# Altium schematic sheet obc-v2_POWER.SchDoc
size 420 x 297 mm; SheetNumber: 3; SheetTotal: 21
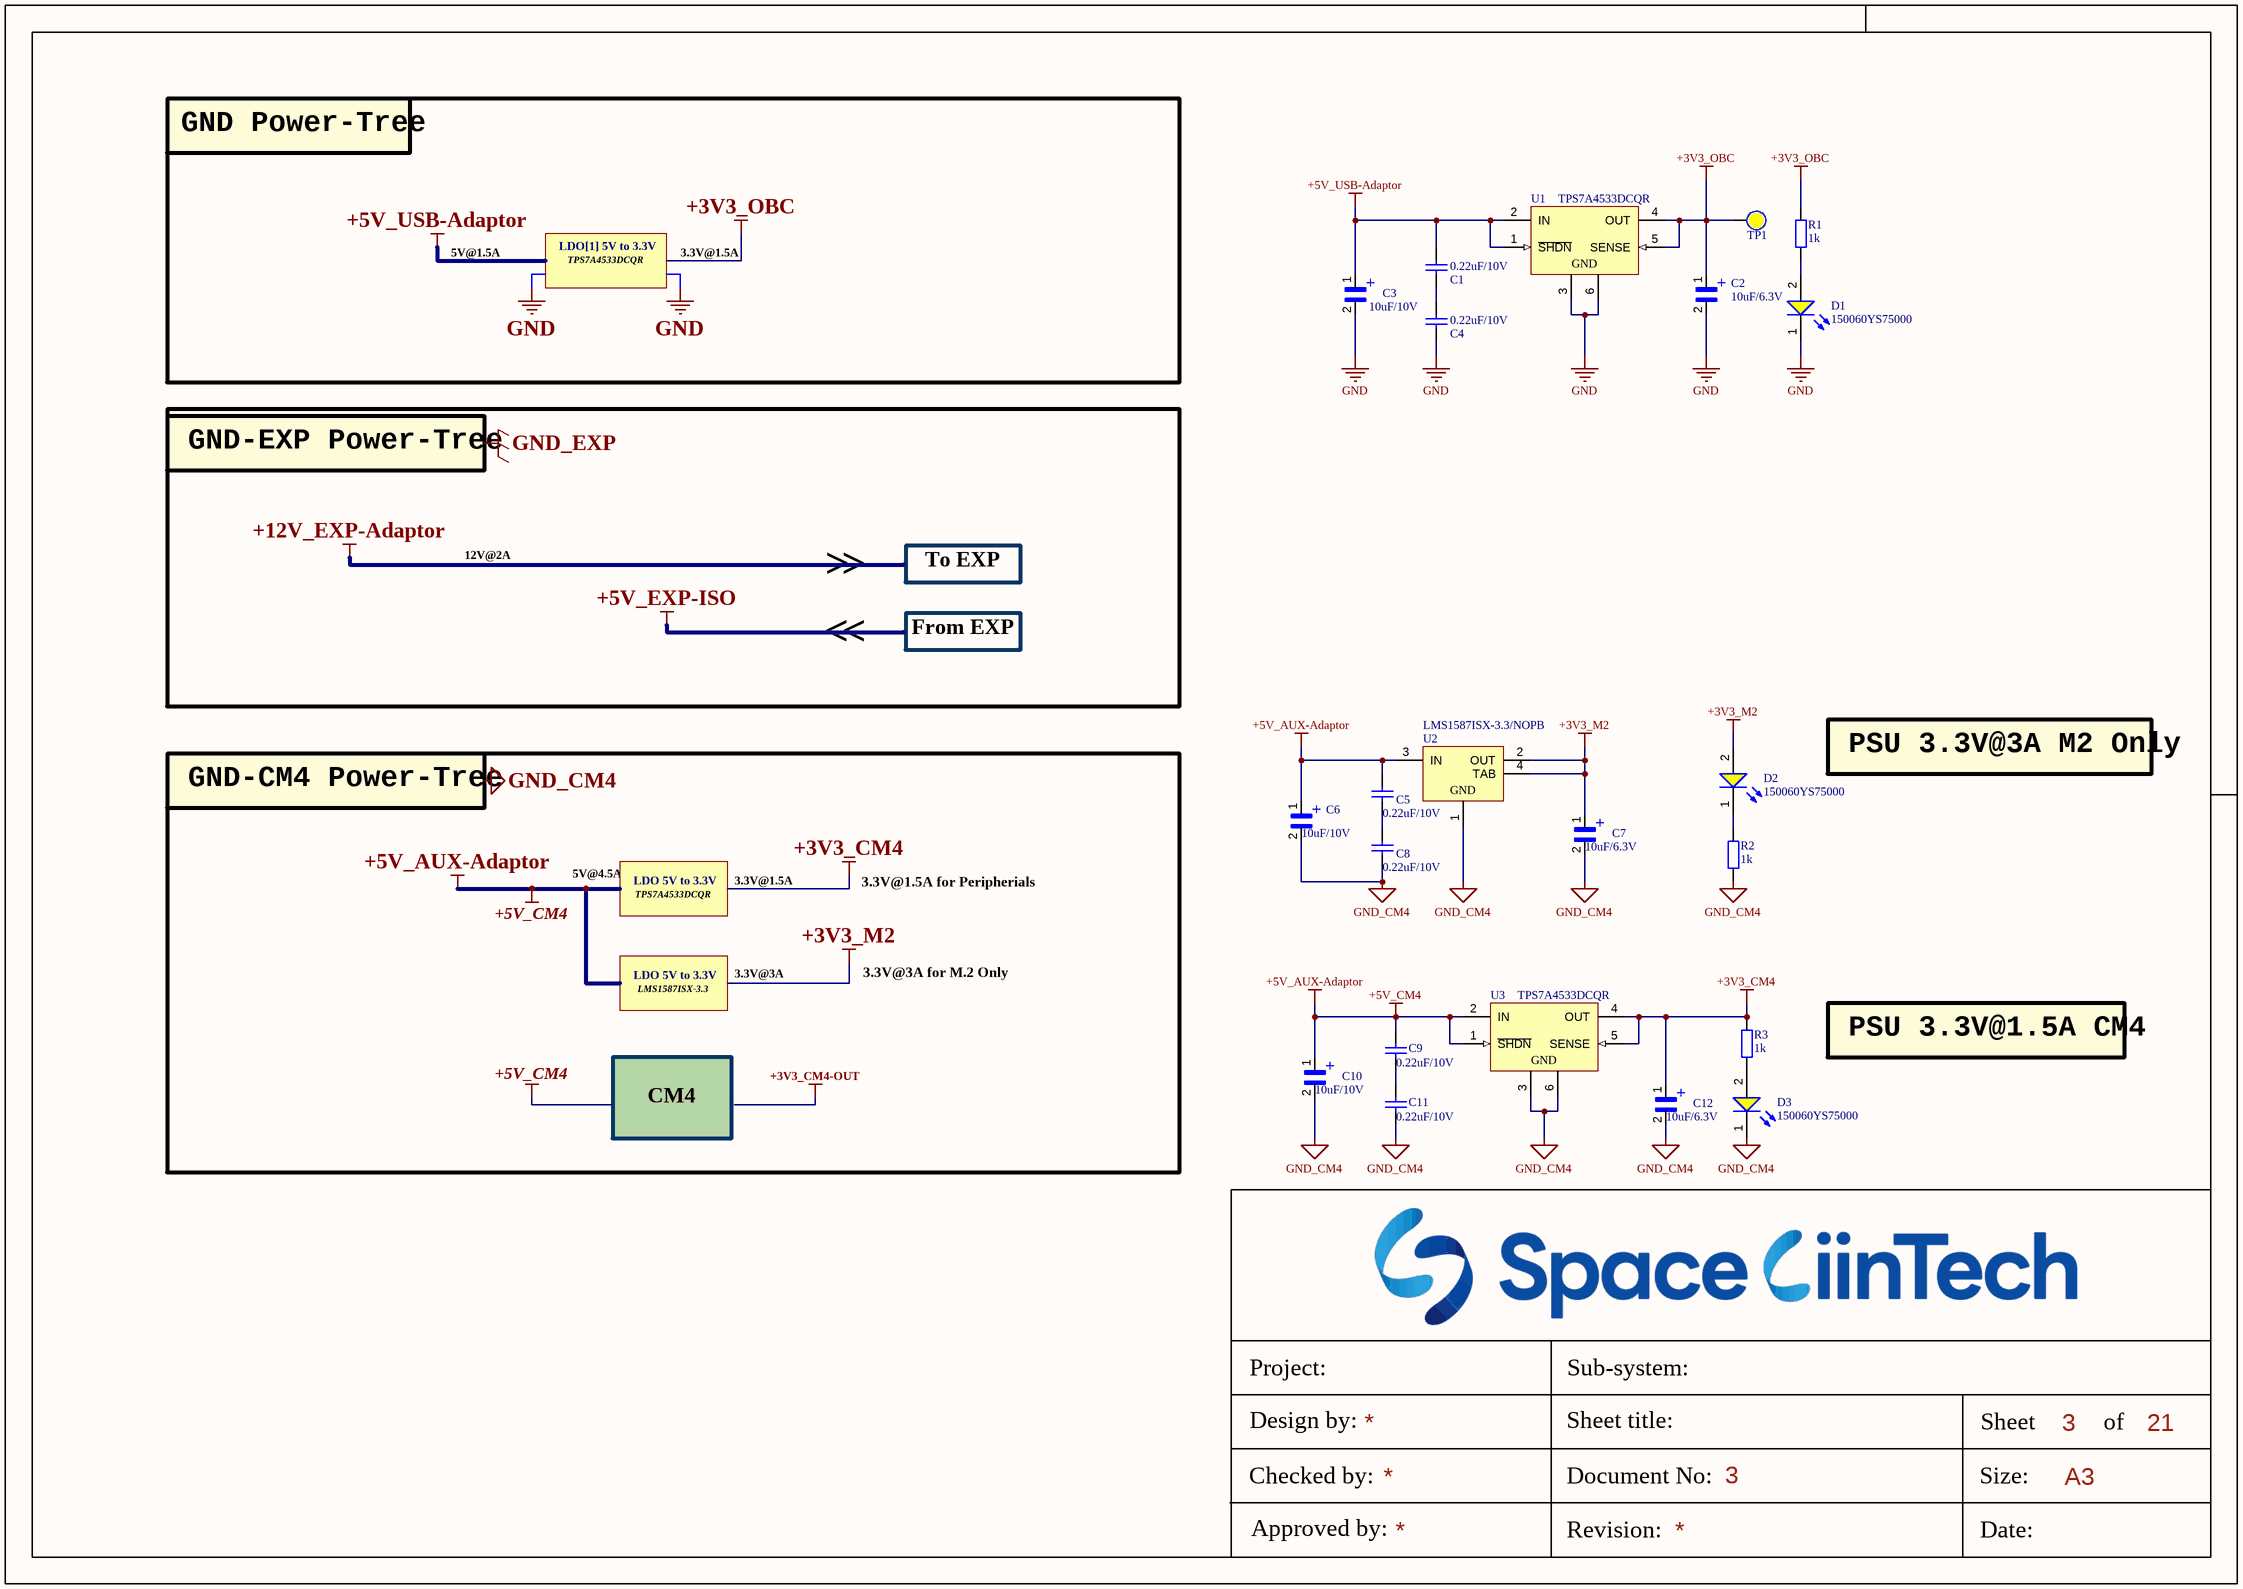
[diagram p0: obc-v2_POWER.SchDoc]

## Parts
C1  0.22uF/10V  [CAP_C_1005X60]
C2  10uF/6.3V  [CAP_MP_2012X170]
C3  10uF/10V  [CAP_MP_2012X170]
C4  0.22uF/10V  [CAP_C_1005X60]
C5  0.22uF/10V  [CAP_C_1005X60]
C6  10uF/10V  [CAP_MP_2012X170]
C7  10uF/6.3V  [CAP_MP_2012X170]
C8  0.22uF/10V  [CAP_C_1005X60]
C9  0.22uF/10V  [CAP_C_1005X60]
C10  10uF/10V  [CAP_MP_2012X170]
C11  0.22uF/10V  [CAP_C_1005X60]
C12  10uF/6.3V  [CAP_MP_2012X170]
D1  150060YS75000  [WL-SMCW_0603_150060xx75000]
D2  150060YS75000  [WL-SMCW_0603_150060xx75000]
D3  150060YS75000  [WL-SMCW_0603_150060xx75000]
R1  1k  [RES_C_1608X60]
R2  1k  [RES_C_1608X60]
R3  1k  [RES_C_1608X60]
TP1  (no value)  [Test Point 1 Side]  (no BOM)
U1  TPS7A4533DCQR  [DCQ0006A_M]
U2  LMS1587ISX-3.3/NOPB  [TS3B_L]
U3  TPS7A4533DCQR  [DCQ0006A_M]

## Nets
+3V3_CM4: C12.1 R3.2 U3.4(OUT) U3.5(SENSE)
+3V3_M2: C7.1 D2.2(A) U2.2(OUT) U2.4(TAB)
+3V3_OBC: C2.1 R1.2 TP1.0 U1.4(OUT) U1.5(SENSE)
+5V_AUX-Adaptor: C5.1 C6.1 C9.1 C10.1 U2.3(IN) U3.1(~{SHDN}) U3.2(IN)  [also labelled +5V_CM4]
+5V_USB-Adaptor: C1.1 C3.1 U1.1(~{SHDN}) U1.2(IN)
GND: C2.2 C3.2 C4.2 D1.1(K) U1.3(GND) U1.6(GND)
GND_CM4: C6.2 C7.2 C8.2 C10.2 C11.2 C12.2 D3.1(K) R2.2 U2.1(GND) U3.3(GND) U3.6(GND)
NetC1_2: C1.2 C4.1
NetC5_2: C5.2 C8.1
NetC9_2: C9.2 C11.1
NetD1_2: D1.2(A) R1.1
NetD2_1: D2.1(K) R2.1
NetD3_2: D3.2(A) R3.1

## Notes on the sheet
- GND Power-Tree
- 5V@1.5A
- LDO[1] 5V to 3.3V
- TPS7A4533DCQR
- 3.3V@1.5A
- GND-EXP Power-Tree
- 12V@2A
- >
- To EXP
- <
- From EXP
- GND-CM4 Power-Tree
- PSU 3.3V@3A M2 Only
- 5V@4.5A
- LDO 5V to 3.3V
- 3.3V@1.5A for Peripherials
- LMS1587ISX-3.3
- 3.3V@3A
- 3.3V@3A for M.2 Only
- PSU 3.3V@1.5A CM4
- CM4
- Labels drawn without touching a wire or pin: GND, GND_CM4, GND_EXP
- Project:
- Sub-system:
- Design by:
- Sheet title:
- Sheet
- A3
- of
- Checked by:
- Approved by:
- Revision:
- Document No:
- Size:
- Date:
- (in symbol TACR686M003RTA) +

## Library data of the parts
C1 C4 C5 C8 C9 C11 = Tu 0402 33nF 10V: CAPC; Chung_Loai: Dán; Don_Vi: Con; So_Chan: 2; Ten_Linh_Kien: Tụ 0402 33nF X7R 10V GRM155R71A333KA01D; Ma_Hang: MH007853; Kieu_Chan: *
C2 C3 C6 C7 C10 C12 = TACR686M003RTA: CAPP; MF: AVX; Availability: Unavailable; SnapEDA_Link: https://www.snapeda.com/parts/TACR686M003RTA/AVX/view-part/1745975/?ref=snap; MP: TACR686M003RTA; Value: *; Price: None; Package: 0805 AVX
D1-D3 = CMP-1426-00005-2: LED YELLOW CLEAR 0603 SMD; NexarPartId: 29687085; Wavelength: 590nm; Luminous Intensity: 120mcd; Peak Wavelength: 595nm; Forward Current: 100mA; Power Dissipation: 72mW; Forward Voltage: 2V; Test Current: 20mA; Reverse Voltage: 5V; Lens Style: Clear, Rectangular; Max Junction Temperature (Tj): 95°C; Viewing Angle: 140°; Case Code (Imperial): 0603; Height: 700µm; REACH SVHC: Unknown; Dominant Wavelength: 590nm; Min Operating Temperature: -40°C; Color: Yellow; Width: 800µm; Mount: Surface Mount; Packaging: Tape and Reel; Max Operating Temperature: 85°C; RoHS: Compliant; Max Reverse Voltage (DC): 5V; Case Code (Metric): 1608; Length: 1.6mm; Case/Package: 0603
R1-R3 = Tro 0603 1% 10k: RES; Chung_Loai: Dán; Don_Vi: Con; So_Chan: 2; Ten_Linh_Kien: Trở 0603 1% 10k; Ma_Hang: MH006333; Kieu_Chan: *
TP1 = Test Point: Solder: NF
U1 U3 = CMP-0395-00360-2: Single Output Fast Transient Response LDO, 1.5 A, Fixed 3.3 V Output, 2.1 to 20 V Input, 6-pin SOT-223 (DCQ), -40 to 125 degC, Green (RoHS & no Sb/Br); Manufacturer: Texas Instruments; Vout Adj(Max)(V): 3.3; Vin(Max)(V): 20; Accuracy(%): 1; SubFamily: Single Channel LDO; Vin(Min)(V): 2.1; Iout(Max)(A): 1.5; Vdo(Typ)(mV): 300; Eco-Plan: Green (RoHS & no Sb/Br); Mounting Technology: Surface Mount; PackageDescription: 6-Pin Plastic Small Outline, Body 3.5 x 6.5 mm, Pitch 1.27 mm; ComponentLink2URL: http://www.ti.com/general/docs/lit/getliterature.tsp?genericPartNumber=TPS7A4533&fileType=pdf; PackageReference: DCQ0006A; ComponentLink3Description: Package Specification; ComponentLink2Description: Datasheet; Fixed Output Options(V): 3.3; Iq(Typ)(mA): 1; ComponentLink1URL: http://www.ti.com/; PartNumber: TPS7A4533DCQR; ComponentLink1Description: Manufacturer URL; PackageVersion: 4202109/D; Vout Adj(Min)(V): 3.3; DatasheetVersion: SLVS720D; ComponentLink3URL: http://www.ti.com/litv/pdf/mpds098c
U2 = CMP-0062-00180-3: 3A Low Dropout Fast Response Regulators, 3-pin TO-263, Pb-Free; Manufacturer: National Semiconductor; PowerWise: N; High-Reliability: Y; PackageTopMarking: NSUZXYTTE#*LMS1587*IS-3.3; CompType: LDO IC; ComponentLink1Description: Manufacturer URL; PackageReference: TS3B; ComponentLink1URL: http://www.national.com/; ComponentLink2URL: http://www.national.com/ds/LM/LMS1587.pdf; DatasheetVersion: Jun-2005; ComponentLink3URL: http://www.national.com/pf/LM/LMS1587.html; PartNumber: LMS1587ISX-3.3/NOPB; RevisionNote: SCH symbol layout adjusted; PinCount: 3; RoHS: Y; Code_JEDEC: MO-169-AA; PackageDescription: TO-263, Molded, .400 x .390 x .180in, 3 Lead, .1in Pitch, Surface Mount; ComponentLink4Description: TS3B Package Page; ComponentLink3Description: LMS1587 Web Page; PackageVersion: revF, Apr-2005; ComponentLink2Description: LMS1587 Datasheet; ComponentLink4URL: http://www.national.com/packaging/folders/ts3b.html